# Altium schematic sheet main.SchDoc: Main.SchDoc
size A4; DocumentNumber: 1; SheetNumber: 1; SheetTotal: 5; PageSetup: Record=PageOptions|CenterHorizontal=True|CenterVertical=True|PrintScale=0.73|XCorrection=1.00|YCorrection=1.00|PrintKind=1|BorderSize=5000000|LeftOffset=0|BottomOffset=0|Orientation=2|PaperLength=1000|PaperWidth=1000|Scale=100|PaperSource=257|PrintQuality=1200|MediaType=1|DitherType=10|PaperKind=A4|PrintScaleMode=1
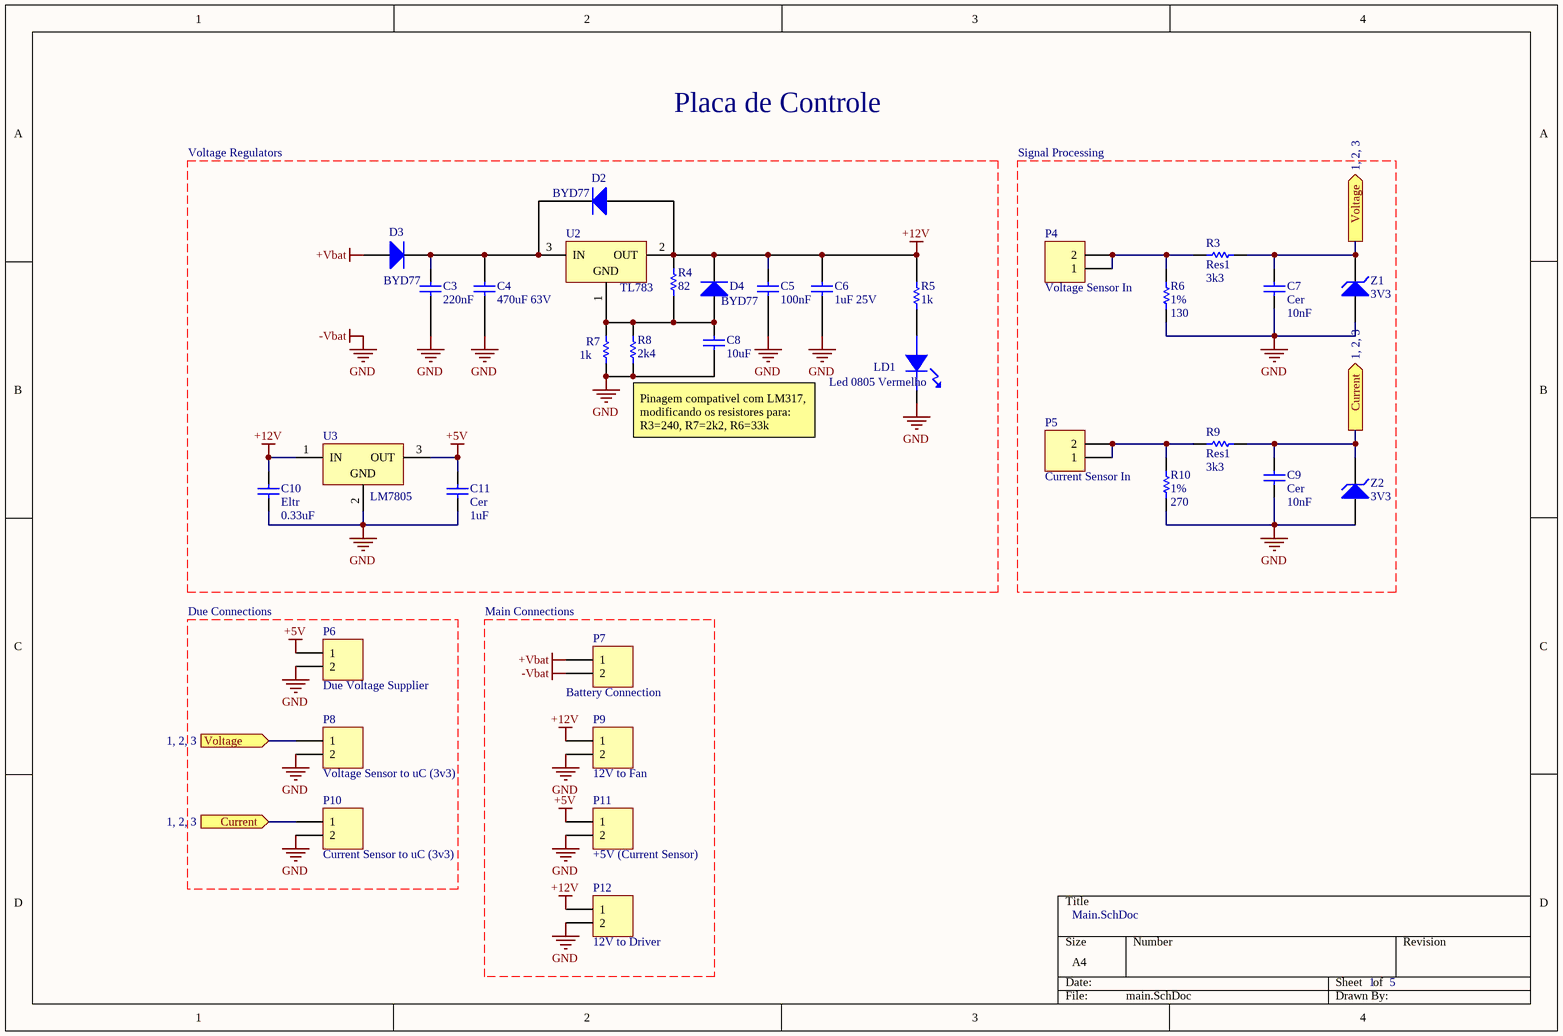
[diagram p0: main.SchDoc]

## Parts
C3  value 220nF  [RESC2012M]  (hidden comment: Cap)
C4  value 470uF 63V  [CapEltr-Rad6.6-Dpp4.5]  (hidden comment: Cap)
C5  value 100nF  [CAPC2012L]  (hidden comment: Cap)
C6  value 1uF 25V  [CapEltr-Rad4.1-Dpp3.0]  (hidden comment: Cap)
C7  Cer  value 10nF  [CAPC2012L]
C8  value 10uF  [CAPC2012L]  (hidden comment: Cap)
C9  Cer  value 10nF  [CAPC2012L]
C10  Eltr  value 0.33uF  [cap33n63v]
C11  Cer  value 1uF  [1u25v]
D2  BYD77  [SOD87]
D3  value BYD77  [SOD87]  (hidden comment: Diode 1N4002)
D4  value BYD77  [SOD87]  (hidden comment: 1N4002)
LD1  value Led 0805 Vermelho  [RESC2012M]  (hidden comment: RED)
P4  Voltage Sensor In  [HDR1X2]
P5  Current Sensor In  [HDR1X2]
P6  Due Voltage Supplier  [HDR1X2]
P7  Battery Connection  [HDR1X2]
P8  Voltage Sensor to uC (3v3)  [HDR1X2]
P9  12V to Fan  [HDR1X2]
P10  Current Sensor to uC (3v3)  [HDR1X2]
P11  +5V (Current Sensor)  [HDR1X2]
P12  12V to Driver  [HDR1X2]
R3  Res1  value 3k3  [RESC2012M]
R4  value 82  [RESC2012M]  (hidden comment: Res1)
R5  value 1k  [RESC2012M]  (hidden comment: Res1)
R6  1%  value 130  [RESC2012M]
R7  value 1k  [RESC2012M]  (hidden comment: Res1)
R8  value 2k4  [RESC2012M]  (hidden comment: Res1)
R9  Res1  value 3k3  [RESC2012M]
R10  1%  value 270  [RESC2012M]
U2  TL783  [TO-220AB]
U3  LM7805  [TO-220AB]
Z1  3V3  [DO-41]
Z2  3V3  [DO-41]

## Ports
Current (in, see 1, 2, 3), Current (out, see 1, 2, 3), Voltage (in, see 1, 2, 3), Voltage (out, see 1, 2, 3)

## Nets
+5V: C11.2 P6.1 P11.1 U3.3(OUT)
+12V: C5.2 C6.2 C10.2 D2.1(A) D4.2(K) P9.1 P12.1 R4.1 R5.2 U2.2(OUT) U3.1(IN)
+Vbat: D3.1(A) P7.1
-Vbat: C3.1 C4.1 C5.1 C6.1 C7.1 C8.1 C9.1 C10.1 C11.1 LD1.2 P6.2 P7.2 P8.2 P9.2 P10.2 P11.2 P12.2 R6.1 R7.1 R8.1 R10.1 U3.2(GND) Z1.1(A) Z2.1(A)  [also labelled GND]
Current: C9.2 P10.1 R9.2 Z2.2(K) ; port Current
Voltage: C7.2 P8.1 R3.2 Z1.2(K) ; port Voltage
NetC3_2: C3.2 C4.2 D2.2(K) D3.2(K) U2.3(IN)
NetC8_2: C8.2 D4.1(A) R4.2 R7.2 R8.2 U2.1(ADJ)
NetLD1_1: LD1.1 R5.1
NetP4_1: P4.1 P4.2 R3.1 R6.2
NetP5_1: P5.1 P5.2 R9.1 R10.2

## Notes on the sheet
- Placa de Controle
- Voltage Regulators
- Signal Processing
- Pinagem compativel com LM317, modificando os resistores para:
  R3=240, R7=2k2, R6=33k
- Due Connections
- (near P7) Main Connections
- (in symbol L7805ACV) GND

## Library data of the parts
C3-C11 = Cap: Capacitor; Published: 8-Jun-2000; LatestRevisionDate: 17-Jul-2002; LatestRevisionNote: Re-released for DXP Platform.; PackageReference: RAD-0.3; Publisher: Altium Limited; PackageDescription: Radial Cap, Thru-Hole; 2 Leads; 0.3 in Pin Spacing
D2-D4 = Diode 1N4002: 1 Amp General Purpose Rectifier; pin to pad: 1>A 2>K; Published: 8-Jun-2000; LatestRevisionDate: 17-Jul-2002; LatestRevisionNote: Re-released for DXP Platform.; DatasheetVersion: 1998; PackageVersion: Aug-1999; PackageReference: DO-41; Publisher: Altium Limited; PackageDescription: Diode, Axial; Body 5.2 x 2.7 mm (LxDia. max), Lead Dia. 0.86 mm (max); Code_JEDEC: DO-204-AL; ComponentLink1Description: Manufacturer Link; ComponentLink1URL: http://www.fairchildsemi.com/; ComponentLink2Description: Datasheet; ComponentLink2URL: http://www.fairchildsemi.com/ds/1N%2F1N4001.pdf
  D2: value: BYD77
LD1 = LED: Diodo Emissor de Luz
P4-P12 = Header 2: Header, 2-Pin; LatestRevisionDate: 17-Jul-2002; LatestRevisionNote: Re-released for DXP Platform.; Publisher: Altium Limited
R3-R10 = Res1: Resistor; Published: 8-Jun-2000; LatestRevisionDate: 17-Jul-2002; LatestRevisionNote: Re-released for DXP Platform.; PackageReference: AXIAL-0.3; Publisher: Altium Limited; PackageDescription: Axial Device, Thru-Hole; 2 Leads; 0.3 in Pin Spacing
U2 = L7805ACV: Precision 1A Regulator; Note: Tab is connected to pin 3 (GND).; value: LT783; Published: 24-Aug-2001; LatestRevisionDate: 17-Jul-2002; LatestRevisionNote: Re-released for DXP Platform.; DatasheetVersion: Nov-1999; PackageVersion: Jun-1998; PackageReference: TO220ABN; Publisher: Altium Limited; PackageDescription: TO, Thru-Hole, Vertical, Heatsink Mounted; 3 In-Line Leads; Pitch 2.54 mm; Pin sequence 1, 3, 2; ComponentLink1Description: Manufacturer Link; ComponentLink1URL: http://www.st.com/; ComponentLink2Description: Datasheet; ComponentLink2URL: http://www.st.com/stonline/products/literature/ds/2144/l7805ab.pdf
U3 = µA7805CKC: Positive-Voltage Regulator; Note: Pin 2 is electrically connected to TAB.; Published: 15-Apr-2002; DatasheetVersion: Jul-1999; PackageVersion: Sep-1995; PackageReference: KC03; Publisher: Altium Limited; PackageDescription: TO, Thru-Hole, Vertical, Heatsink Mounted; 3 In-Line Leads; Pitch 2.54 mm; ComponentLink1Description: Manufacturer Link; ComponentLink1URL: http://www.ti.com/; ComponentLink2Description: Datasheet; ComponentLink2URL: http://www-s.ti.com/sc/ds/ua7805.pdf
Z1 Z2 = D Zener: Zener Diode; Published: 8-Jun-2000; LatestRevisionDate: 17-Jul-2002; LatestRevisionNote: Re-released for DXP Platform.; PackageReference: DIODE-0.7; Publisher: Altium Limited; PackageDescription: Diode, Thru-Hole; 2 Leads; 0.7 in Pin Spacing